# Altium schematic sheet LED_POWER.SchDoc: Power Structure
size A4; CompanyName: Scootify Incorporated; DrawnBy: Gabriel Soares; Revision: REV0
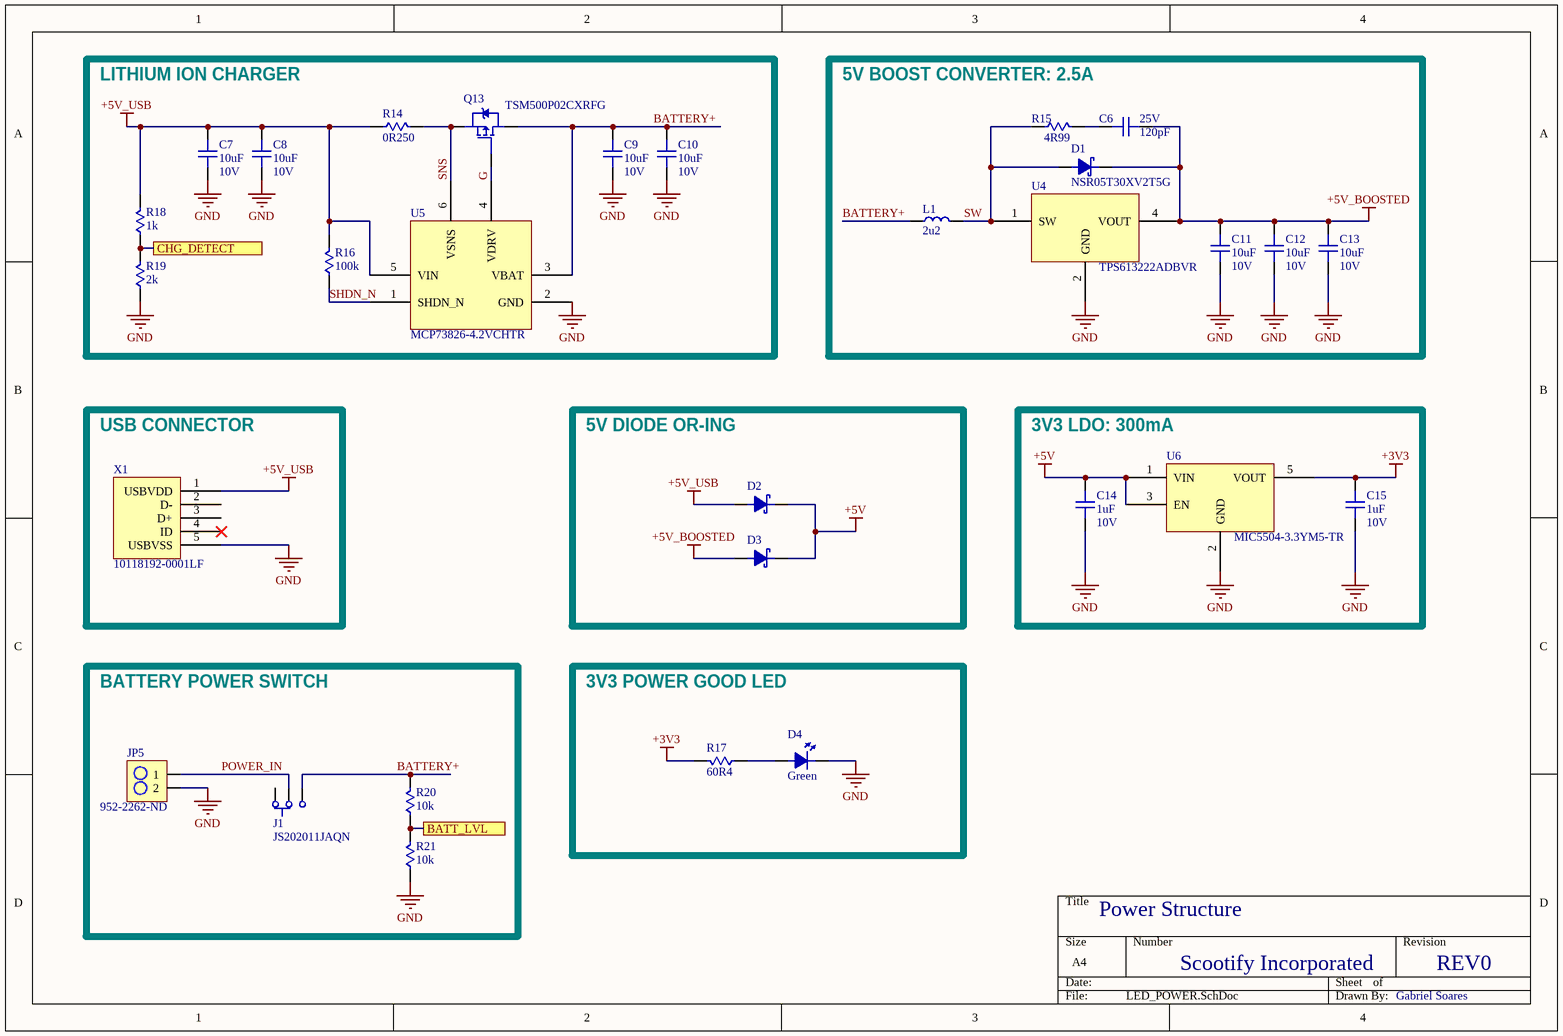
[diagram p0: LED_POWER.SchDoc]

## Parts
C6  120pF  Voltage Rating: 25V  [C0402]
C7  10uF  Voltage Rating (DC): 10V  [C0603]
C8  10uF  Voltage Rating (DC): 10V  [C0603]
C9  10uF  Voltage Rating (DC): 10V  [C0603]
C10  10uF  Voltage Rating (DC): 10V  [C0603]
C11  10uF  Voltage Rating (DC): 10V  [C0603]
C12  10uF  Voltage Rating (DC): 10V  [C0603]
C13  10uF  Voltage Rating (DC): 10V  [C0603]
C14  1uF  Voltage Rating: 10V  [C0402]
C15  1uF  Voltage Rating: 10V  [C0402]
D1  NSR05T30XV2T5G  [SOD-523]
D2  RB511SM-30FHT2R  [SOD-523]  (value not drawn)
D3  RB511SM-30FHT2R  [SOD-523]  (value not drawn)
D4  Green  [LED_0603]
J1  JS202011JAQN  [SWITCH]
JP5  952-2262-ND  [2PIN_HEADER]
L1  2u2  [INDUCTOR]
Q13  TSM500P02CXRFG  [SOT23-3_PMOS]
R14  0R250  [R1206]
R15  4R99  [R0402]
R16  100k  [R0402]
R17  60R4  [R0402]
R18  1k  [R0402]
R19  2k  [R0402]
R20  10k  [R0402]
R21  10k  [R0402]
U4  TPS613222ADBVR  [SOT23-5_TPS61233]
U5  MCP73826-4.2VCHTR  [SOT23-6_MCP73826]
U6  MIC5504-3.3YM5-TR  [SOT23-5_MIC5504]
X1  10118192-0001LF  [USB_MICRO]

## Blocks framed on the sheet
LITHIUM ION CHARGER: C7-C10 Q13 R14 R16 R18 R19 U5
5V BOOST CONVERTER: 2.5A: C6 C11-C13 D1 L1 R15 U4
USB CONNECTOR: X1
5V DIODE OR-ING: D2 D3
3V3 LDO: 300mA: C14 C15 U6
BATTERY POWER SWITCH: J1 JP5 R20 R21
3V3 POWER GOOD LED: D4 R17

## Ports
BATT_LVL, CHG_DETECT

## Nets
+3V3: C15.2 R17.2 U6.5(VOUT)
+5V: C14.2 D2.2 D3.2 U6.1(VIN) U6.3(EN)
+5V_BOOSTED: C6.2 C11.2 C12.2 C13.2 D1.2 D3.1 U4.4(VOUT)
+5V_USB: C7.2 C8.2 D2.1 R14.1 R16.2 R18.2 U5.5(VIN) X1.1(USBVDD)
GND: C7.1 C8.1 C9.1 C10.1 C11.1 C12.1 C13.1 C14.1 C15.1 D4.2 JP5.2 R19.1 R21.1 U4.2(GND) U5.2(GND) U6.2(GND) X1.5(USBVSS)
BATT_LVL: R20.1 R21.2 ; port BATT_LVL
BATTERY+: C9.2 C10.2 J1.3 L1.1 Q13.3 R20.2 U5.3(VBAT)
CHG_DETECT: R18.1 R19.2 ; port CHG_DETECT
G: Q13.1 U5.4(VDRV)
POWER_IN: J1.2 JP5.1
SHDN_N: R16.1 U5.1(SHDN_N)
SNS: Q13.2 R14.2 U5.6(VSNS)
SW: D1.1 L1.2 R15.1 U4.1(SW)
NetC6_1: C6.1 R15.2
NetD4_1: D4.1 R17.1

Not connected (* = marked no-connect by the designer): J1 1; X1 2(D-) 3(D+) 4(ID)*

## Library data of the parts
C6 = C0402C121J3GAC7867: CAP MLCC 120pF 25V 0402; Manufacturer: KEMET; Tolerance: 5%; Supplier 1: Digi-Key; Manufacturer Part Number: C0402C121J3GAC7867; Stock 1: 30252; Pricing 1: 1=0.1, 10=0.039, 100=0.0175, 500=0.0125, 1000=0.0098, 2500=0.0089, 5000=0.0082 (USD); Mount: Surface Mount; Case/Package: 0402; Case Code (Imperial): 0402; Case Code (Metric): 1005; Min Operating Temperature: -55°C; Max Operating Temperature: 125°C; Packaging: Tape and Reel; Capacitance: 120pF; Supplier Part Number 1: 399-14880-1-ND
C7-C13 = GRM188R61A106KE69J: CAP MLCC 10uF 10V 0603; Manufacturer: Murata; Dielectric: X5R; Tolerance: 10%; Supplier 1: Digi-Key; Manufacturer Part Number: GRM188R61A106KE69J; Stock 1: 202850; Pricing 1: 1=0.21, 10=0.141, 100=0.0713, 500=0.0488, 1000=0.0431, 2500=0.0413, 5000=0.0375 (USD); Capacitance: 10uF; Length: 1.6mm; Width: 800um; Thickness: 800um; Supplier Part Number 1: 490-14372-1-ND
C14 C15 = CL05A105MP5NNNC: CAP MLCC 1uF 10V 0402; Manufacturer: Samsung; Tolerance: 20%; Dielectric: X5R; Supplier 1: Digi-Key; Manufacturer Part Number: CL05A105MP5NNNC; Stock 1: 3892098; Pricing 1: 1=0.1, 10=0.038, 100=0.0169, 500=0.0121, 1000=0.0095, 2500=0.0086, 5000=0.008 (USD); Mount: Surface Mount; Case/Package: 0402; Case Code (Metric): 1005; Case Code (Imperial): 0402; Min Operating Temperature: -55°C; Max Operating Temperature: 85°C; Package Quantity: 1; Packaging: Tape and Reel; Capacitance: 1uF; Voltage Rating (DC): 10V; Length: 1mm; Height: 0.5mm; Width: 0.02inch; Thickness: 0.022inch; Depth: 0.5mm; Radiation Hardening: No; Lead Free: Lead Free; ComponentLink1URL: http://www.samsungsem.com/kr/support/product-search/mlcc/CL05A105MP5NNNC.jsp?src-supplier=Digi-Key; ComponentLink1Description: http://www.samsungsem.com/kr/support/product-search/mlcc/CL05A105MP5NNNC.jsp?src-supplier=Digi-Key; Supplier Part Number 1: 1276-1448-1-ND
D1 = NSR05T30XV2T5G: DIODE SCHOTTKY 30V 500MA SOD523; Manufacturer: ON Semiconductor; Reverse Recovery Time: 23ns; Supplier 1: Digi-Key; Manufacturer Part Number: NSR05T30XV2T5G; Stock 1: 10419; Pricing 1: 1=0.32, 10=0.266, 100=0.1409, 500=0.0927, 1000=0.063 (USD); Mount: Surface Mount; Packaging: Cut Tape; Max Reverse Voltage (DC): 30V; Average Rectified Current: 500mA; Supplier Part Number 1: NSR05T30XV2T5GOSCT-ND
D2 D3 = RB511SM-30FHT2R: DIODE SCHOTTKY 370mV Forward Voltage @ 10mA, 30V Reverse Voltage RB511SM-30FHT2R             Schottky Rectifier, 30 V, 100 mA, Single, SOD-523, 2 Pins, 370 mV                          New; Manufacturer: Rohm; Forward Current: 100mA; Max Forward Surge Current (Ifsm): 500mA; Supplier 1: Digi-Key; Manufacturer Part Number: RB511SM-30FHT2R; Stock 1: 6514; Pricing 1: 1=0.17, 10=0.16, 100=0.0869, 500=0.0535, 1000=0.0365, 2500=0.031 (USD); Number of Pins: 2; Max Operating Temperature: 125°C; Max Repetitive Reverse Voltage (Vrrm): 30V; Forward Voltage: 370mV; Packaging: Cut Tape; Element Configuration: Single; REACH SVHC: No SVHC; Supplier Part Number 1: RB511SM-30FHT2RCT-ND
D4 = IN-S63AT5G: LED GREEN CLEAR 0603 SMD; Manufacturer: Inolux; Lens Style: Flat; Luminous Intensity: 350mcd; Forward Voltage: 3V; Test Current: 5mA; Viewing Angle: 120°; Dominant Wavelength: 525nm; Lens Size: 0.8mm; Supplier 1: Digi-Key; Manufacturer Part Number: IN-S63AT5G; Stock 1: 2843; Pricing 1: 1=0.55, 10=0.393, 25=0.3012, 100=0.1966, 250=0.1442, 500=0.1223, 1000=0.1005 (USD); Mount: Surface Mount; Case/Package: 0603; Color: Green; Lens Color: Clear; Case Code (Imperial): 0603; Case Code (Metric): 1608; Packaging: Tape and Reel; Lens Transparency: Clear; Length: 1.6mm; Height: 0.39mm; Width: 0.8mm; Supplier Part Number 1: 1830-1062-1-ND
J1 = JS202011JAQN: SWITCH SLIDE DPDT 300MA 6V; Manufacturer: ITT C&K; Actuator Material: Nylon,Polyamide; Switch Function: On-On; Actuator Type: Standard; Switch Travel: 2mm; Electrical Life: 5000Cycles; Supplier 1: Digi-Key; Manufacturer Part Number: JS202011JAQN; Stock 1: 3321; Pricing 1: 1=0.51, 10=0.488, 25=0.4776, 50=0.4268, 100=0.4066, 250=0.3964, 500=0.3354 (USD); Mount: Surface Mount; Contact Material: Copper Alloy; Contact Plating: Silver; Min Operating Temperature: -40°C; Max Operating Temperature: 85°C; Throw Configuration: DPDT; Packaging: Cut Tape; Current Rating: 300mA; Voltage Rating (DC): 6V; Actuator Length: 2mm; Supplier Part Number 1: CKN10722CT-ND
JP5 = M20-9990246: CONN_HeaderPins2pos Headers & Wire Housings 02 SIL VERTICAL PIN HEADER TIN; Manufacturer: Harwin; Contact Resistance: 30mR; Max Current Rating: 3A; Number of Positions: 2; Gender: Male; Connector Type: Male Pin; Insulation Resistance: 10GR; Voltage Rating (AC): 750V; Pitch: 2.54mm; Supplier 1: Digi-Key; Manufacturer Part Number: M20-9990246; Stock 1: 53577; Pricing 1: 1=0.11, 10=0.099, 100=0.0609, 500=0.0504, 1000=0.0441, 5000=0.0378, 10000=0.0368 (USD); Case/Package: SIL; Colour: Black; Housing Colour: Black; Housing Material: Nylon; Contact Plating: Tin; Contact Material: Bronze,Brass; Min Operating Temperature: -40°C; Max Operating Temperature: 105°C; Package Quantity: 1000; Packaging: Bulk; Termination: Solder; Number of Rows: 1; Number of Contacts: 2; Orientation: Straight; Current Rating: 3A; Length: 5.08mm; Depth: 2.54mm; Contact Mating Length: 0.24inch; Radiation Hardening: No; REACH SVHC: No SVHC; ComponentLink1URL: https://datasheet.ciiva.com/8046/315376-8046930.pdf; ComponentLink1Description: https://datasheet.ciiva.com/8046/315376-8046930.pdf; ComponentLink2URL: https://datasheet.ciiva.com/6833/m20-999-6833368.pdf; ComponentLink2Description: https://datasheet.ciiva.com/6833/m20-999-6833368.pdf; ComponentLink3URL: https://datasheet.ciiva.com/11745/0900766b81034e61-11745755.pdf; ComponentLink3Description: https://datasheet.ciiva.com/11745/0900766b81034e61-11745755.pdf; ComponentLink4URL: https://datasheet.ciiva.com/22660/1830818-22660571.pdf; ComponentLink4Description: https://datasheet.ciiva.com/22660/1830818-22660571.pdf; ComponentLink5URL: https://datasheet.ciiva.com/26852/getdatasheetpartid-384170-26852203.pdf; ComponentLink5Description: https://datasheet.ciiva.com/26852/getdatasheetpartid-384170-26852203.pdf; Supplier Part Number 1: 952-2262-ND
L1 = CIGT252008LM2R2MNE (2): IND 2.2uH 2.1A Saturation Current; Manufacturer: Samsung; Core Material: Metal,Composite; Tolerance: 20%; Current Rating: 2A; Shielding: Unshielded; DC Resistance (DCR): 97mR; Test Frequency: 1MHz; Supplier 1: Digi-Key; Manufacturer Part Number: CIGT252008LM2R2MNE; Stock 1: 8715; Pricing 1: 1=0.22, 10=0.197, 100=0.1314, 500=0.1095, 1000=0.092 (USD); Mount: Surface Mount; Case/Package: 1008; Case Code (Imperial): 1008; Case Code (Metric): 2520; Min Operating Temperature: -40°C; Max Operating Temperature: 125°C; Composition: Thin Film; Packaging: Cut Tape; Inductance: 2.2uH; Saturation Current: 2.1A; Supplier Part Number 1: 1276-6925-1-ND
Q13 = TSM500P02CXRFG: MOSFET P-CH 20V 4.7A 1.56W Rds(ON)=50mOhm; Manufacturer: Taiwan Semiconductor; Rds On Max: 50mR; Input Capacitance: 850pF; Supplier 1: Digi-Key; Manufacturer Part Number: TSM500P02CXRFG; Stock 1: 9267; Pricing 1: 1=0.39, 10=0.309, 100=0.2123, 500=0.1456, 1000=0.1092 (USD); Mount: Surface Mount; Case/Package: SOT-23; Packaging: Tape and Reel; Drain to Source Voltage (Vdss): 20V; Continuous Drain Current (ID): 4.7A; Max Power Dissipation: 1.56W; Supplier Part Number 1: TSM500P02CXRFGCT-ND
R14 = PT1206FR-7W0R25L: RES SMD 250mOhm 0.5W 1206; Manufacturer: Yageo; Resistance: 250mR; Tolerance: 1%; Max Power Dissipation: 500mW; Temperature Coefficient: 75ppm/°C; Supplier 1: Digi-Key; Manufacturer Part Number: PT1206FR-7W0R25L; Stock 1: 13947; Pricing 1: 1=0.47, 10=0.364, 25=0.2768, 50=0.2056, 100=0.1528, 250=0.1291, 500=0.1107, 1000=0.0843 (USD); Case/Package: 1206; Min Operating Temperature: -55°C; Max Operating Temperature: 155°C; Packaging: Tape and Reel; Composition: Thick Film; Number of Terminations: 2; Features: Moisture Resistant,Automotive AEC-Q200; Length: 0.122inch; Height: 0.026inch; Width: 0.063inch; Supplier Part Number 1: YAG5802CT-ND
R15 = RMCF0402FT4R99: RES SMD 4.99 OHM 0402; Manufacturer: Stackpole Electronics; Resistance: 4.99R; Tolerance: 1%; Max Power Dissipation: 63mW; Temperature Coefficient: 200ppm/°C; Supplier 1: Digi-Key; Manufacturer Part Number: RMCF0402FT4R99; Stock 1: 144934; Pricing 1: 1=0.1, 10=0.02, 100=0.0082, 1000=0.0037, 2500=0.0032, 5000=0.0026 (USD); Mount: Surface Mount; Case/Package: 0402; Case Code (Metric): 1005; Case Code (Imperial): 0402; Contact Plating: Tin,Matte; Min Operating Temperature: -55°C; Max Operating Temperature: 155°C; Packaging: Tape and Reel; Package Quantity: 1; Composition: Thick Film; Number of Terminations: 2; Features: Automotive AEC-Q200; Length: 0.039inch; Height: 0.016inch; Width: 0.02inch; Lead Free: Contains Lead; Supplier Part Number 1: RMCF0402FT4R99CT-ND
R16 = RMCF0402FT100K: RES SMD 100K 0402; Manufacturer: Stackpole Electronics; Tolerance: 1%; Resistance: 100kR; Power Rating: 62.5mW; Temperature Coefficient: 100ppm/°C; Max Power Dissipation: 63mW; Supplier 1: Digi-Key; Manufacturer Part Number: RMCF0402FT100K; Stock 1: 796221; Pricing 1: 1=0.1, 10=0.015, 100=0.0061, 1000=0.0028, 2500=0.0024, 5000=0.002 (USD); Mount: Surface Mount; Case/Package: 0402; Case Code (Metric): 1005; Case Code (Imperial): 0402; Contact Plating: Tin,Matte; Min Operating Temperature: -55°C; Max Operating Temperature: 155°C; Packaging: Tape and Reel; Composition: Thick Film; Number of Terminations: 2; Military Standard: Not; Features: Automotive AEC-Q200; Length: 1mm; Height: 0.016inch; Width: 0.02inch; Depth: 0.5mm; Radiation Hardening: No; Lead Free: Lead Free; ComponentLink1URL: https://www.verical.com/server-webapp/html/getDatasheet?partID=482656&src-supplier=Verical; ComponentLink1Description: https://www.verical.com/server-webapp/html/getDatasheet?partID=482656&src-supplier=Verical; Supplier Part Number 1: RMCF0402FT100KCT-ND
R17 = RMCF0402FT60R4: RES SMD 60.4 OHM 1% 1/16W 0402; Manufacturer: Stackpole Electronics; Resistance: 60.4R; Max Power Dissipation: 63mW; Temperature Coefficient: 100ppm/°C; Supplier 1: Digi-Key; Manufacturer Part Number: RMCF0402FT60R4; Stock 1: 28531; Pricing 1: 1=0.1, 10=0.015, 100=0.0061, 1000=0.0028, 2500=0.0024, 5000=0.002 (USD); Mount: Surface Mount; Case/Package: 0402; Case Code (Metric): 1005; Case Code (Imperial): 0402; Contact Plating: Tin,Matte; Min Operating Temperature: -55°C; Max Operating Temperature: 155°C; Packaging: Tape and Reel; Tolerance: 1%; Composition: Thick Film; Number of Terminations: 2; Features: Automotive AEC-Q200; Length: 0.039inch; Height: 0.016inch; Width: 0.02inch; Radiation Hardening: No; Lead Free: Lead Free; Supplier Part Number 1: RMCF0402FT60R4CT-ND
R18 = RR0510P-102-D: RES SMD 1K OHM 0.5% 1/16W 0402; Manufacturer: Susumu; Resistance: 1kR; Power Rating: 63mW; Voltage Rating: 25V; Temperature Coefficient: 25ppm/°C; Supplier 1: Digi-Key; Manufacturer Part Number: RR0510P-102-D; Stock 1: 721157; Pricing 1: 1=0.1, 10=0.074, 100=0.0285, 1000=0.0125, 2500=0.0108, 5000=0.0097 (USD); Case/Package: 0402; Number of Pins: 2; Case Code (Metric): 1005; Case Code (Imperial): 0402; Min Operating Temperature: -55°C; Max Operating Temperature: 125°C; Package Quantity: 1; Tolerance: 0.5%; Packaging: Tape and Reel; Composition: Thin Film; Number of Terminations: 2; Termination: SMD/SMT; Max Power Dissipation: 63mW; Voltage Rating (DC): 25V; Length: 0.039inch; Height: 0.016inch; Width: 0.02inch; REACH SVHC: Unknown; Lead Free: Lead Free; ComponentLink1URL: http://www.susumu.co.jp/common/pdf/n_catalog_partition05_en.pdf; ComponentLink1Description: http://www.susumu.co.jp/common/pdf/n_catalog_partition05_en.pdf; ComponentLink2URL: http://www.farnell.com/datasheets/1581132.pdf; ComponentLink2Description: http://www.farnell.com/datasheets/1581132.pdf; Supplier Part Number 1: RR05P1.0KDCT-ND
R19 = RC0402FR-072KL: RES SMD 2K OHM 1% 1/16W 0402; Manufacturer: Yageo; Resistance: 2kR; Power Rating: 63mW; Voltage Rating: 50V; Temperature Coefficient: 100ppm/°C; Supplier 1: Digi-Key; Manufacturer Part Number: RC0402FR-072KL; Stock 1: 12787794; Pricing 1: 1=0.1, 10=0.016, 100=0.0067, 1000=0.003, 2500=0.0026, 5000=0.0022 (USD); Case/Package: 0402; Case Code (Metric): 1005; Case Code (Imperial): 0402; Min Operating Temperature: -55°C; Max Operating Temperature: 155°C; Tolerance: 1%; Package Quantity: 1; Packaging: Tape and Reel; Composition: Thick Film; Number of Terminations: 2; Termination: SMD/SMT; Military Standard: Not; Max Power Dissipation: 63mW; Voltage Rating (DC): 50V; Working Voltage: 50V; Features: Moisture Resistant; Length: 1mm; Height: 0.016inch; Width: 0.02inch; Depth: 0.5mm; REACH SVHC: Unknown; Lead Free: Lead Free; ComponentLink1URL: http://www.yageo.com/documents/recent/PYu-RC_Group_51_RoHS_L_10.pdf?src-supplier=Digi-Key; ComponentLink1Description: http://www.yageo.com/documents/recent/PYu-RC_Group_51_RoHS_L_10.pdf?src-supplier=Digi-Key; ComponentLink2URL: http://documents.rs-components.com/techlib://itc_doclist_GB.htm?stockno=6186510&src-supplier=RSComponents; ComponentLink2Description: http://documents.rs-components.com/techlib://itc_doclist_GB.htm?stockno=6186510&src-supplier=RSComponents; ComponentLink3URL: https://www.verical.com/server-webapp/html/getDatasheet?partID=358921&src-supplier=Verical; ComponentLink3Description: https://www.verical.com/server-webapp/html/getDatasheet?partID=358921&src-supplier=Verical; ComponentLink4URL: http://www.mouser.com/ds/2/447/PYu-RC0402_51_RoHS_L_6_r-8721.pdf?src-supplier=Mouser; ComponentLink4Description: http://www.mouser.com/ds/2/447/PYu-RC0402_51_RoHS_L_6_r-8721.pdf?src-supplier=Mouser; ComponentLink5URL: http://www.farnell.com/datasheets/1018594.pdf?src-supplier=Element14; ComponentLink5Description: http://www.farnell.com/datasheets/1018594.pdf?src-supplier=Element14; ComponentLink6URL: http://www.farnell.com/datasheets/2167052.pdf?src-supplier=Element14; ComponentLink6Description: http://www.farnell.com/datasheets/2167052.pdf?src-supplier=Element14; Supplier Part Number 1: 311-2KLRCT-ND
R20 R21 = RC0402JR-0710KL: RES SMD 10K OHM 5% 1/16W 0402; Manufacturer: Yageo; Resistance: 10kR; Power Rating: 62.5mW; Voltage Rating: 50V; Temperature Coefficient: 100ppm/°C; Max Power Dissipation: 63mW; Supplier 1: Digi-Key; Manufacturer Part Number: RC0402JR-0710KL; Stock 1: 47303622; Pricing 1: 1=0.1, 10=0.018, 100=0.0073, 1000=0.0033, 2500=0.0029, 5000=0.0024 (USD); Case/Package: 0402; Case Code (Metric): 1005; Case Code (Imperial): 0402; Min Operating Temperature: -55°C; Max Operating Temperature: 155°C; Packaging: Tape and Reel; Tolerance: 5%; Package Quantity: 1; Composition: Thick Film; Number of Terminations: 2; Termination: SMD/SMT; Military Standard: Not; Features: Moisture Resistant; Length: 1mm; Height: 0.016inch; Width: 0.02inch; Depth: 0.5mm; REACH SVHC: Unknown; Lead Free: Lead Free; Supplier Part Number 1: 311-10KJRCT-ND
U4 = TPS613222ADBVR: IC DCDC BOOST CONVERTER 5V OUTPUT 2.5A; Manufacturer: Texas Instruments; Output Type: Fixed; Output Configuration: Positive; Number of Outputs: 1; Min Input Voltage: 900mV; Max Input Voltage: 5.5V; Switching Frequency: 2MHz; Synchronous Rectifier: Yes; Supplier 1: Digi-Key; Manufacturer Part Number: TPS613222ADBVR; Stock 1: 2444; Pricing 1: 1=0.84, 10=0.747, 100=0.5828, 500=0.4814, 1000=0.3801 (USD); Mount: Surface Mount; Case/Package: SOT-23-5; Min Operating Temperature: -40°C; Max Operating Temperature: 85°C; Topology: Boost; Packaging: Tape and Reel; Min Output Voltage: 5V; Output Current: 2.5A; ComponentLink1URL: http://www.ti.com/lit/gpn/tps61322?src-supplier=Digi-Key; ComponentLink1Description: http://www.ti.com/lit/gpn/tps61322?src-supplier=Digi-Key; Supplier Part Number 1: 296-50503-1-ND
U5 = MCP73826-4.2VCHTR: IC BATT CHARGER LI-ION 4.2V CCCV WITH 43% CURRENT DEPLETION MODE; Manufacturer: Microchip; Min Supply Voltage: 4.5V; Max Supply Voltage: 5.5V; Number of Cells: 1; Output Current: 75mA; Operating Supply Current: 260uA; Max Output Voltage: 4.24V; Min Output Voltage: 4.158V; Nominal Supply Current: 560mA; Supplier 1: Digi-Key; Manufacturer Part Number: MCP73826-4.2VCHTR; Stock 1: 379; Pricing 1: 1=0.93, 25=0.7724, 100=0.7004 (USD); Mount: Surface Mount; Case/Package: SOT-23; Number of Pins: 6; Min Operating Temperature: -20°C; Max Operating Temperature: 85°C; Package Quantity: 1; Packaging: Tape and Reel; Output Voltage: 4.2V; Length: 3mm; Height: 1.3mm; Width: 1.75mm; Radiation Hardening: No; REACH SVHC: No SVHC; Lead Free: Lead Free; ComponentLink1URL: http://www.microchip.com/mymicrochip/filehandler.aspx?ddocname=en026002&src-supplier=Digi-Key; ComponentLink1Description: http://www.microchip.com/mymicrochip/filehandler.aspx?ddocname=en026002&src-supplier=Digi-Key; ComponentLink2URL: http://www.microchip.com/mymicrochip/filehandler.aspx?ddocname=en023833&src-supplier=Digi-Key; ComponentLink2Description: http://www.microchip.com/mymicrochip/filehandler.aspx?ddocname=en023833&src-supplier=Digi-Key; ComponentLink3URL: http://www.farnell.com/datasheets/1789214.pdf?src-supplier=Farnell; ComponentLink3Description: http://www.farnell.com/datasheets/1789214.pdf?src-supplier=Farnell; ComponentLink4URL: http://www.farnell.com/datasheets/1789214.pdf?src-supplier=Element14; ComponentLink4Description: http://www.farnell.com/datasheets/1789214.pdf?src-supplier=Element14; ComponentLink5URL: http://www.mouser.com/ds/2/268/21705a-63878.pdf?src-supplier=Mouser; ComponentLink5Description: http://www.mouser.com/ds/2/268/21705a-63878.pdf?src-supplier=Mouser; ComponentLink6URL: http://ww1.microchip.com/downloads/jp/DeviceDoc/21705a.pdf?src-supplier=Avnet+Europe; ComponentLink6Description: http://ww1.microchip.com/downloads/jp/DeviceDoc/21705a.pdf?src-supplier=Avnet+Europe; ComponentLink7URL: http://uk.rs-online.com/webdocs/0806/0900766b808065c8.pdf?src-supplier=RSComponents; ComponentLink7Description: http://uk.rs-online.com/webdocs/0806/0900766b808065c8.pdf?src-supplier=RSComponents; Supplier Part Number 1: MCP73826-4.2VCHCT-ND
U6 = MIC5504-3.3YM5-TR: IC LDO 3V3 300mA 5V INPUT; Manufacturer: Microchip Micrel; Min Input Voltage: 2.5V; Max Input Voltage: 5.5V; Nominal Output Voltage: 3.3V; Dropout Voltage: 380mV; Output Type: Fixed; Number of Outputs: 1; Quiescent Current: 38uA; Accuracy: 3%; Operating Supply Current: 42uA; Power Supply Rejection Ratio (PSRR): 60dB; Supplier 1: Digi-Key; Manufacturer Part Number: MIC5504-3.3YM5-TR; Stock 1: 30791; Pricing 1: 1=0.11, 25=0.0928, 100=0.0824 (USD); Mount: Surface Mount; Case/Package: SOT-23-5; Number of Pins: 5; Min Operating Temperature: -40°C; Max Operating Temperature: 125°C; Output Current: 300mA; Packaging: Tape and Reel; Output Voltage: 3.3V; Max Output Current: 300mA; Length: 2.9mm; Height: 1.1mm; Width: 1.6mm; REACH SVHC: No SVHC; ComponentLink1URL: http://www.farnell.com/datasheets/1856860.pdf?src-supplier=Element14; ComponentLink1Description: http://www.farnell.com/datasheets/1856860.pdf?src-supplier=Element14; Supplier Part Number 1: 576-4764-1-ND
X1 = 10118192-0001LF: CONN_USB - micro B USB 2.0 Receptacle Connector 5 Position Surface Mount, Right Angle, Horizontal; Manufacturer: Amphenol FCI; Current Rating: 1.8A; Connector Type: USB,Receptacle; Number of Contacts: 5; Insulation Resistance: 1GR; Number of Ports: 1; Max Voltage Rating (AC): 100V; USB Standard: USB 2.0; Pitch: 0.65mm; Supplier 1: Digi-Key; Manufacturer Part Number: 10118192-0001LF; Stock 1: 197826; Pricing 1: 1=0.46, 10=0.437, 25=0.3744, 50=0.318, 100=0.3056, 250=0.2744, 500=0.262 (USD); Mount: Surface Mount,Horizontal; Contact Material: Copper Alloy; Contact Plating: Nickel,Gold; Number of Terminals: 5; Housing Material: Polymer; Colour: Black; Min Operating Temperature: -55°C; Max Operating Temperature: 85°C; Packaging: Tape and Reel; Package Quantity: 1400; Gender: Receptacle; Termination: Solder; Voltage Rating: 100V; Orientation: Right Angle; Length: 7.86mm; Depth: 5.57mm; Radiation Hardening: No; REACH SVHC: No SVHC; Lead Free: Lead Free; Flammability Rating: UL94 V-0; ComponentLink1URL: https://datasheet.ciiva.com/26853/getdatasheetpartid-418041-26853891.pdf; ComponentLink1Description: https://datasheet.ciiva.com/26853/getdatasheetpartid-418041-26853891.pdf; ComponentLink2URL: https://datasheet.ciiva.com/851/10118192-851112.pdf; ComponentLink2Description: https://datasheet.ciiva.com/851/10118192-851112.pdf; ComponentLink3URL: https://datasheet.ciiva.com/4598/10118192ac-197249-4598796.pdf; ComponentLink3Description: https://datasheet.ciiva.com/4598/10118192ac-197249-4598796.pdf; Supplier Part Number 1: 609-4613-1-ND